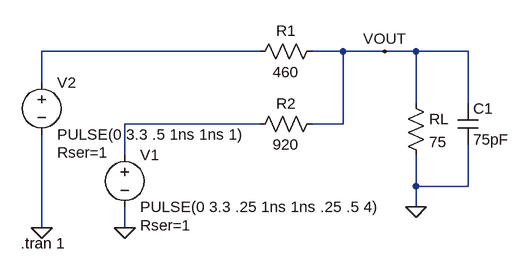
[diagram p0: schematic DAC_Sim_2R.asc]
DAC_Sim_2R.asc, the LTspice schematic file:
Version 4
SHEET 1 880 680
WIRE -64 -32 -400 -32
WIRE 64 -32 16 -32
WIRE 128 -32 64 -32
WIRE 176 -32 128 -32
WIRE 256 -32 176 -32
WIRE -400 16 -400 -32
WIRE 176 48 176 -32
WIRE 256 48 256 -32
WIRE -64 80 -272 80
WIRE 64 80 64 -32
WIRE 64 80 16 80
WIRE -272 128 -272 80
WIRE 176 176 176 128
WIRE 256 176 256 112
WIRE 256 176 176 176
WIRE 176 208 176 176
WIRE -400 240 -400 96
WIRE -272 240 -272 208
FLAG -272 240 0
FLAG -400 240 0
FLAG 176 208 0
FLAG 128 -32 VOUT
SYMBOL res 32 64 R90
WINDOW 0 0 56 VBottom 2
WINDOW 3 32 56 VTop 2
SYMATTR InstName R2
SYMATTR Value 920
SYMBOL res 32 -48 R90
WINDOW 0 0 56 VBottom 2
WINDOW 3 32 56 VTop 2
SYMATTR InstName R1
SYMATTR Value 460
SYMBOL voltage -272 112 R0
WINDOW 123 0 0 Left 0
WINDOW 39 24 124 Left 2
SYMATTR SpiceLine Rser=1
SYMATTR InstName V1
SYMATTR Value PULSE(0 3.3 .25 1ns 1ns .25 .5 4)
SYMBOL voltage -400 0 R0
WINDOW 123 0 0 Left 0
WINDOW 39 24 124 Left 2
SYMATTR SpiceLine Rser=1
SYMATTR InstName V2
SYMATTR Value PULSE(0 3.3 .5 1ns 1ns 1)
SYMBOL res 160 32 R0
SYMATTR InstName RL
SYMATTR Value 75
SYMBOL cap 240 48 R0
SYMATTR InstName C1
SYMATTR Value 75pF
TEXT -432 264 Left 2 !.tran 1

The netlist it stands for:
* DAC_Sim_2R.asc
R2 VOUT N002 920
R1 VOUT N001 460
V1 N002 0 PULSE(0 3.3 .25 1ns 1ns .25 .5 4) Rser=1
V2 N001 0 PULSE(0 3.3 .5 1ns 1ns 1) Rser=1
RL VOUT 0 75
C1 VOUT 0 75pF
.tran 1
.backanno
.end